# EAGLE schematic accessory 40x40_temp (EAGLE 7.4.0)
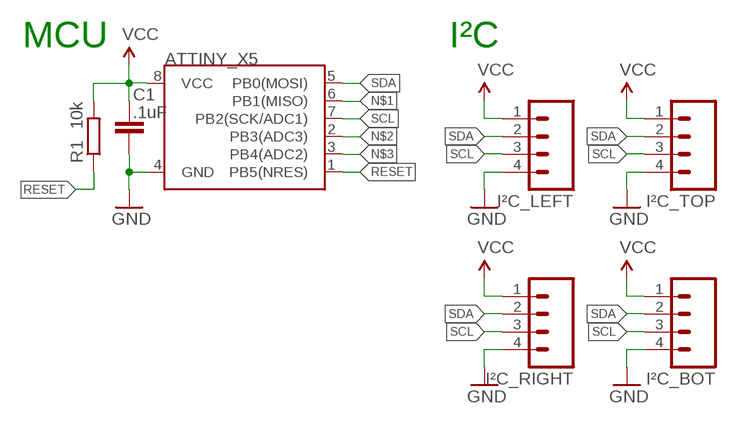
[diagram p0: schematic, sheet 1]

## Parts
ATTINY_X5  ATTINY45TINY45-20-SMT  [SO08-EIAJ]
C1  .1uF  CAPACITOR_NPOL-0805  [C805]
I²C_BOT  M04PTH  [1X04]
I²C_LEFT  M04PTH  [1X04]
I²C_RIGHT  M04PTH  [1X04]
I²C_TOP  M04PTH  [1X04]
R1  10k  RESISTORR805-0805  [R805]

## Nets
GND: ATTINY_X5.4(GND) C1.2 I²C_BOT.4 I²C_LEFT.4 I²C_RIGHT.4 I²C_TOP.4
N$1: ATTINY_X5.6(PB1(MISO))
N$2: ATTINY_X5.2(PB3(ADC3))
N$3: ATTINY_X5.3(PB4(ADC2))
RESET: ATTINY_X5.1(PB5(NRES)) R1.1
SCL: ATTINY_X5.7(PB2(SCK/ADC1)) I²C_BOT.3 I²C_LEFT.3 I²C_RIGHT.3 I²C_TOP.3
SDA: ATTINY_X5.5(PB0(MOSI)) I²C_BOT.2 I²C_LEFT.2 I²C_RIGHT.2 I²C_TOP.2
VCC: ATTINY_X5.8(VCC) C1.1 I²C_BOT.1 I²C_LEFT.1 I²C_RIGHT.1 I²C_TOP.1 R1.2

## Notes on the sheet
- MCU | I²C

## Library data of the parts
ATTINY_X5 = SparkFun-DigitalIC:ATTINY45: Atmel 8-pin 2/4/8kB flash uC; PROD_ID: IC-08922; VALUE: Tiny45-20-SMT
C1 = dp_devices:CAPACITOR_NPOL: Non-Polarized capacitor in various packages
I²C_BOT I²C_LEFT I²C_RIGHT I²C_TOP = SparkFun-Connectors:M04: Header 4 Standard 4-pin 0.1" header. Use with straight break away headers (SKU : PRT-00116), right angle break away headers (PRT-00553), swiss pins (PRT-00743), machine pins (PRT-00117), and female headers (PRT-00115). Molex polarized connector foot print use with SKU : PRT-08231 with associated crimp pins and housings. 1MM SMD Version SKU: PRT-10208
R1 = dp_devices:RESISTOR